# Altium project M1-PCB.PrjPcb
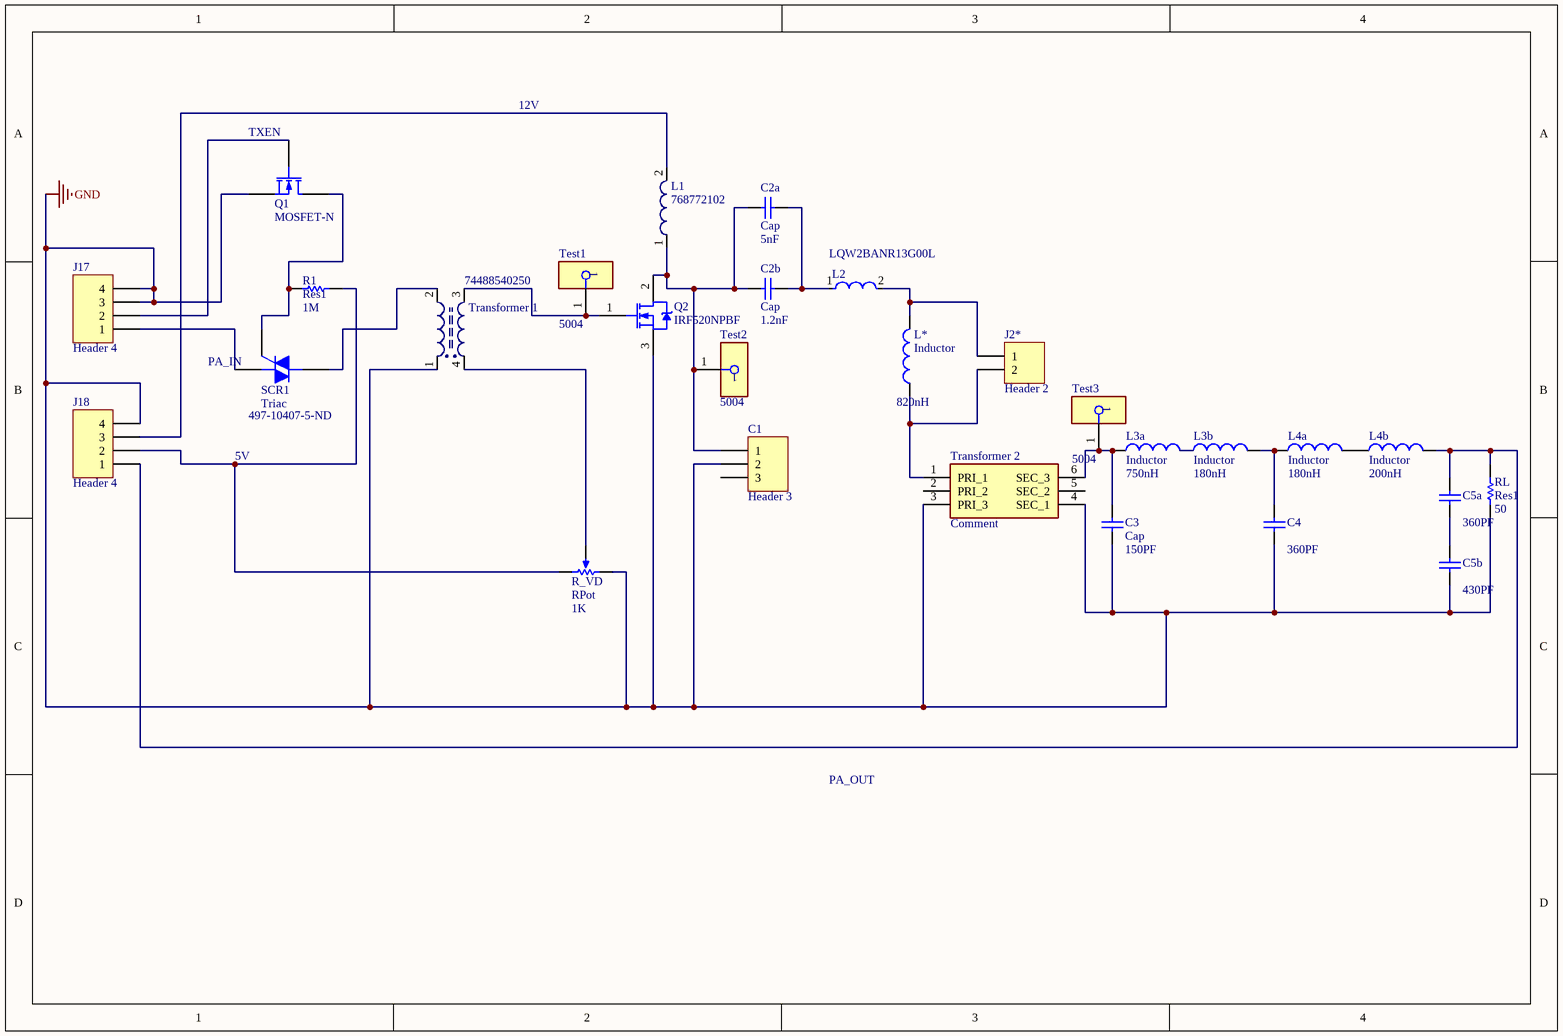
[diagram p0: schematic.SchDoc]
1 sheet, 28 parts. Net scope: global (net labels, ports and power ports of the same name join across sheets).
Board file: PCB_M2.PcbDoc

## Sheet schematic.SchDoc
size A4; SheetNumber: 1; SheetTotal: 1; SPICEModelCacheVFORKPWS: <root> / <DocumentId>VFORKPWS</DocumentId> / <CacheFrame Number="0"> / <Model Name="nmos" Kind="MDL"> / <Text>*Default N-Channel MOSFET / *Pinout: D,G,S / .MODEL NMOS NMOS()</Text> / </Model> / </CacheFrame> / </root>

### Parts
C1  Header 3  [Potentiometer]
C2a  Cap  value 5nF  [RAD-0.1]
C2b  Cap  value 1.2nF  [RAD-0.1]
C3  Cap  value 150PF  [RAD-0.1]
C4  value 360PF  [RAD-0.1]  (hidden comment: Cap)
C5a  value 360PF  [RAD-0.1]  (hidden comment: Cap)
C5b  value 430PF  [RAD-0.1]  (hidden comment: Cap)
J2*  Header 2  [HDR1X2]
J17  Header 4  [HDR1X4]
J18  Header 4  [HDR1X4]
L1  768772102  [8095]
L2  LQW2BANR13G00L  [FP-LQW2BAN_00-MFG]
L3a  Inductor  value 750nH  [2029]
L3b  Inductor  value 180nH  [2029]
L4a  Inductor  value 180nH  [2029]
L4b  Inductor  value 200nH  [2029]
L*  Inductor  value 820nH  [2029]
Q1  MOSFET-N  [Transistor]
Q2  IRF520NPBF  [INTR-TO-220AB-3]
R1  Res1  value 1M  [AXIAL-0.4]
R_VD  RPot  value 1K  [VR5]
RL  Res1  value 50  [AXIAL-0.4]
SCR1  Triac  Supplier Part Number 1: 497-10407-5-ND  [369-03]
Test1  5004  [FP-5004-MFG]
Test2  5004  [FP-5004-MFG]
Test3  5004  [FP-5004-MFG]
Transformer_1  74488540250  [WE-EHPI 5838]
Transformer_2  Comment  [78931812515]

### Nets
GND: C1.2 C3.1 C4.1 C5b.1 J17.3 J17.4 J18.4 Q1.3(S) Q2.3(S) R_VD.1(TOP) RL.1 Transformer_1.1 Transformer_2.3(PRI_3) Transformer_2.4(SEC_1)
NetC1_1: C1.1 C2a.1 C2b.1 L1.1 Q2.2(D) Test2.1
NetC2a_2: C2a.2 C2b.2 L2.1
NetC3_2: C3.2 L3a.1 Test3.1 Transformer_2.6(SEC_3)
NetC4_2: C4.2 L3b.2 L4a.1
NetC5a_1: C5a.1 C5b.2
NetC5a_2: C5a.2 J18.1 L4b.2 RL.2
NetJ2*_1: J2*.1 L2.2 L*.2
NetJ2*_2: J2*.2 L*.1 Transformer_2.1(PRI_1)
NetJ17_1: J17.1 SCR1.1(M1)
NetJ17_2: J17.2 Q1.2(G)
NetJ18_2: J18.2 R1.2 R_VD.2(BOT)
NetJ18_3: J18.3 L1.2
NetL3a_2: L3a.2 L3b.1
NetL4a_2: L4a.2 L4b.1
NetQ1_1: Q1.1(D) R1.1 SCR1.3(G)
NetQ2_1: Q2.1(G) Test1.1 Transformer_1.3
NetR_VD_3: R_VD.3(TAP) Transformer_1.4
NetSCR1_2: SCR1.2(M2) Transformer_1.2

Not connected (* = marked no-connect by the designer): C1 3; Transformer_2 2(PRI_2) 5(SEC_2)

### Notes on the sheet
- 12V
- (near Q1) TXEN
- (near SCR1) PA_IN
- 5V
- PA_OUT

### Library data of the parts
C1 = Header 3: Header, 3-Pin; LatestRevisionDate: 17-Jul-2002; LatestRevisionNote: Re-released for DXP Platform.; Publisher: Altium Limited
C2a C2b C3 = CAP ALUM 1.5UF 20% 50V RADIAL: Ceramic Capacitor, Multilayer, Ceramic, 200V, 10% +Tol, 10% -Tol, X7R, 15% TC, 0.00015uF, Through Hole Mount; Manufacturer Part Number: EEA-GA1H1R5H; Manufacturer: KEMET; Designator: C?; Voltage Rating: 50V; Multilayer: Yes; Published: 8-Jun-2000; LatestRevisionDate: 17-Jul-2002; LatestRevisionNote: Re-released for DXP Platform.; Publisher: Altium Limited; Supplier: Arrow Electronics; Supplier Part Number: C317C151K2R5TA; RoHS: Yes; Category: Ceramic Capacitors; Stock: 1515; Pricing: 1=0.08040, 500=0.06280 (USD); Mounting Technology: Through Hole; Pins: 2; Dielectric Material: Ceramic; Package Shape: Rectangular; Case/Package: 1510; Terminal Finish: Nickel; Min Operating Temperature: -55°C; Max Operating Temperature: 125°C; JESD-609 Code: e3; Capacitor Type: Ceramic; Tolerance  (fill in as +-): 10%; Package Style: RadialMeter; Packaging: Bulk; Tolerance (fill in as +-): 10%; Rated DC Voltage (URdc): 200V; Temperature Characteristics Code: X7R; Termination: Wire; Length: 3.81mm; Width: 2.54mm; Height: 5.84mm; Terminal Pitch: 5.08mm; Reach SVHC Compliant: Yes; RoHS Compliant: Yes; ComponentLink1URL: https://datasheet.ciiva.com:443/pdfs/VipMasterIC/IC/KEME/KEME-S-A0009782347/KEME-S-A0009782347-1.pdf?src-supplier=IHS+Markit; ComponentLink1Description: https://datasheet.ciiva.com:443/pdfs/VipMasterIC/IC/KEME/KEME-S-A0009782347/KEME-S-A0009782347-1.pdf?src-supplier=IHS+Markit; ComponentLink2URL: https://datasheet.ciiva.com/5388/f3101-goldmax-5388710.pdf?src-supplier=Mouser; ComponentLink2Description: https://datasheet.ciiva.com/5388/f3101-goldmax-5388710.pdf?src-supplier=Mouser; Parameter 1: *
C4 C5a C5b = CAP CER 330PF 50V X7R RADIAL: Capacitor; Manufacturer Part Number: K331K15X7RF53L2; Designator: C?; Voltage Rating: 50V; Published: 8-Jun-2000; LatestRevisionDate: 17-Jul-2002; LatestRevisionNote: Re-released for DXP Platform.; Publisher: Altium Limited
J2* = Header 2: Header, 2-Pin; LatestRevisionDate: 17-Jul-2002; LatestRevisionNote: Re-released for DXP Platform.; Publisher: Altium Limited
J17 J18 = Header 4: Header, 4-Pin; LatestRevisionDate: 17-Jul-2002; LatestRevisionNote: Re-released for DXP Platform.; Publisher: Altium Limited
L1 = CMP-1388-00007-1: SMD-Radial Leaded Wire Wound  Inductor WE-TI HV, L=1000 µH; Manufacturer: Wuerth Elektronik; Inductance: 1000 ÂµH; PartNumber: 768772102; ComponentLink1URL: http://www.we-online.com; ComponentLink1Description: Manufacturer URL; ComponentLink2URL: http://www.we-online.de/katalog/media/pdf/768772102.pdf; PackageReference: 8095; ComponentLink2Description: Datasheet
L2 = CMP-06042-013144-1: Wire Wound RF Inductor 130nH ±2% 950mA 0.42Ω 0805 (2015); Shielding: Unshielded; Self Resonant Frequency: 1GHz; DC Resistance (DCR): 420mR; Test Frequency: 150MHz; Current Rating: 950mA; Tolerance: 2%; Height - Seated (Max): 0.06inch; Max Operating Temperature: 125°C; Resistor Type: Wirewound; Case/Package: Nonstandard; Inductance: 130nH; Mount: Surface Mount; Width: 0.06inch; Min Operating Temperature: -55°C; Packaging: Tape and Reel; Length: 0.082inch
L3a L3b L4a L4b L* = Inductor: Code_IEC: 1005; Published: 8-Jun-2000; LatestRevisionDate: 29-May-2009; LatestRevisionNote: IPC-7351 Footprint Added.; PackageReference: 0402-A; Publisher: Altium Limited; PackageDescription: Chip Inductor; Code_JEITA: 0402
Q1 = MOSFET-N: N-Channel MOSFET; Published: 8-Jun-2000; LatestRevisionDate: 17-Jul-2002; LatestRevisionNote: Re-released for DXP Platform.; PackageVersion: 1995/1996; PackageReference: E3; Publisher: Altium Limited; PackageDescription: TO, Flat Index; 3 In-Line, Axial Leads; Body Dia. 4.6mm; Lead Dia. 0.5 mm (max)
Q2 = CMP-2100-03647-1: HEXFET(R) Power MOSFET, 100 V, 9.7 A, 0.2 Ohm, -55 to 175 degC, 3-Pin FM (TO-220AB), RoHS, Tube; Manufacturer: International Rectifier; Element Configuration: Single; Rds On Max: 200mOhm; Drain to Source Voltage (Vdss): 100V; Number of Elements: 1; Continuous Drain Current (ID): 9.7A; Input Capacitance: 330pF; Gate to Source Voltage (Vgs): 20V; Power Dissipation: 48W; Rise Time: 23ns; Turn-Off Delay Time: 32ns; Turn-On Delay Time: 4.5ns; Datasheet URL: http://www.infineon.com/dgdl/irf520npbf.pdf?fileId=5546d462533600a4015355e340711985; Max Operating Temperature: 175degC; Height: 15.24mm; RoHSCompliant: true; Package Description: 3-Pin Flange Mount, Body 4.445 x 10.415 mm, Pitch 2.54 mm; Manufacturer URL: http://internationalrectifier.com/; Length: 10.54mm; Mount: ThroughHole; Lead Free: LeadFree; Drain to Source Resistance: 200mOhm; Drain to Source Breakdown Voltage: 100V; Number of Pins: 3; Case/Package: TO-220AB; Package Quantity: 50; Lead Pitch: 2.54mm; REACH SVHC: NoSVHC; Package Reference: TO-220AB; Radiation Hardening: No; Packaging: Rail/Tube; Min Operating Temperature: -55degC; Width: 4.69mm; Fall Time: 23ns; Max Power Dissipation: 48W; Datasheet Version: 37926.0; Voltage Rating (DC): 100V; Current Rating: 9.7A
R1 RL = RES 150 OHM 5% 1/4W AXIAL: Resistor; Manufacturer Part Number: CFR-25JB-52-150R; Designator: R?; Power Rating: 1/4W; Tolerance: 0.05; Published: 8-Jun-2000; LatestRevisionDate: 17-Jul-2002; LatestRevisionNote: Re-released for DXP Platform.; Publisher: Altium Limited
R_VD = RPot: Potentiometer; pin to pad: 2>3 3>2; Sim Note: Enter the Resistance value and the set point into parameter fields.; Set Position: 0.5; Published: 8-Jun-2000; LatestRevisionDate: 17-Jul-2002; LatestRevisionNote: Re-released for DXP Platform.; PackageReference: VR5; Publisher: Altium Limited; PackageDescription: Variable Resistor, Thru-Hole; 3 Leads
SCR1 = Triac: Silicon Bidirectional Triode Thyristor; Note: Pin 2 is electrically connected to Pin 4 (TAB); Published: 29-Sep-2000; LatestRevisionDate: 17-Jul-2002; LatestRevisionNote: Re-released for DXP Platform.; DatasheetVersion: 1999; PackageReference: 369-03; Publisher: Altium Limited; PackageDescription: TO, Thru-Hole, Vertical, Heatsink Mounted; 3 In-Line Leads; Pitch 2.28 mm; ComponentLink1Description: Manufacturer Link; ComponentLink1URL: http://www.motorola.com/; Supplier 1: Digi-Key
Test1-Test3 = CMP-2000-05575-2: PC TEST POINT MINIATURE YELLOW; Manufacturer: Keystone; Number Of Contacts: 1; Is Female: yes; Device Class L1: Connectors; Manufacturer Part Number: 5004; Digikey Description: PC TEST POINT MINIATURE YELLOW; ComponentLink2URL: https://www.keyelco.com/product-pdf.cfm?p=1313; Lead Free: Yes; ComponentLink2Description: Datasheet; Category: Conn; Height: 4.72mm; Octopart: https://octopart.com/5004-keystone-28591; Mouser Description: TEST POINT PC MINI .040"D YELLOW; Device Class L3: unset; Contact Material: Silver; Package: 5004; Automotive: No; Device Class L2: unset; RoHS: TRUE
Transformer_1 = CMP-1384-00003-1: Energy Harvesting Coupled Inductor,SMD, WE-EHPI, L=25.0 µH; Manufacturer: Wuerth Elektronik; Inductance: 25.0 ÂµH; ComponentLink1Description: Manufacturer URL; PartNumber: 74488540250; ComponentLink1URL: http://www.we-online.com; ComponentLink2URL: http://katalog.we-online.de/pbs/datasheet/74488540250.pdf; PackageReference: WE-EHPI 5838; ComponentLink2Description: Datasheet
Transformer_2 = 78931812515: WE-PSPA Push Pull & Gate Drive Transformer NEW; Manufacturer_Name: Wurth Elektronik; Geometry.Height: 4.1mm; Manufacturer_Part_Number: 78931812515; Mouser Part Number: *; Mouser Price/Stock: *; Arrow Part Number: *; Arrow Price/Stock: *; Datasheet Link: https://www.we-online.com/components/products/datasheet/78931812515.pdf